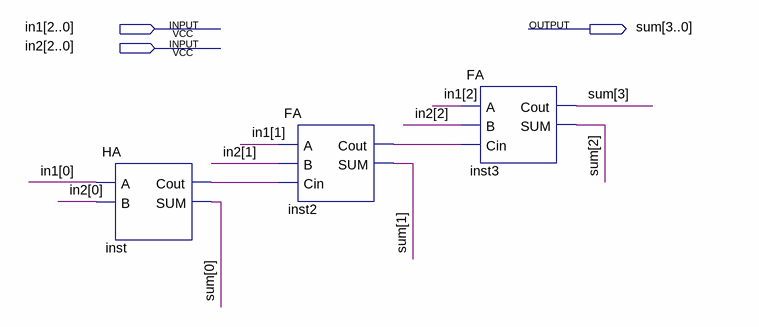
[diagram p0: schematic sheet]
// Quartus schematic 3bit_RCA.bdf as structural Verilog: 3 symbols, 3 pins
module \3bit_RCA  (
  input  [2:0] in1,
  input  [2:0] in2,
  output [3:0] sum
);

  wire inst2_cout, inst_cout;

  HA inst (.A(in1[0]), .B(in2[0]), .Cout(inst_cout), .SUM(sum[0]));
  FA inst2 (.A(in1[1]), .B(in2[1]), .Cin(inst_cout), .Cout(inst2_cout), .SUM(sum[1]));
  FA inst3 (.A(in1[2]), .B(in2[2]), .Cin(inst2_cout), .Cout(sum[3]), .SUM(sum[2]));
endmodule
